# EAGLE schematic Blimp_PCB_v19 (EAGLE 9.7.0)
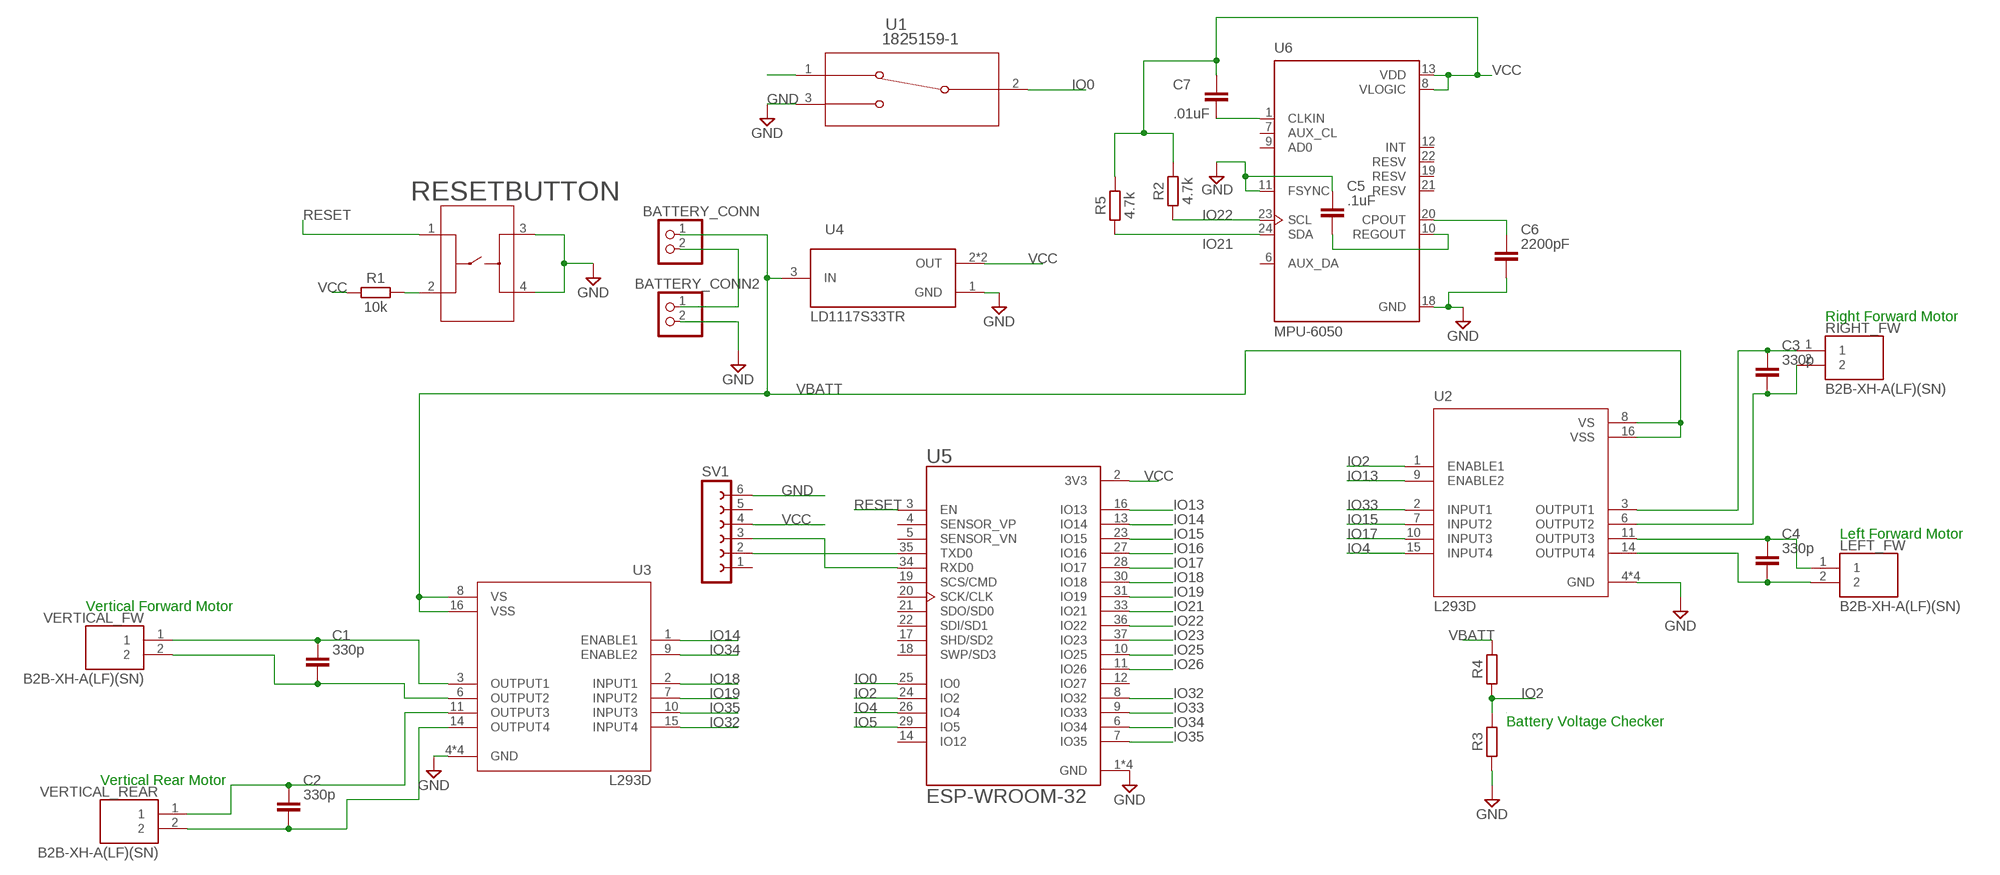
[diagram p0: schematic, sheet 1]

## Parts
BATTERY_CONN  PINHD-1X2  [1X02]
BATTERY_CONN2  PINHD-1X2  [1X02]
C1  330p  C_CHIP-0402(1005-METRIC)  [CAPC1005X60]
C2  330p  C_CHIP-0402(1005-METRIC)  [CAPC1005X60]
C3  330p  C_CHIP-0402(1005-METRIC)  [CAPC1005X60]
C4  330p  C_CHIP-0402(1005-METRIC)  [CAPC1005X60]
C5  .1uF  C_CHIP-0805(2012-METRIC)  [CAPC2012X110]
C6  2200pF  C_CHIP-0805(2012-METRIC)  [CAPC2012X110]
C7  .01uF  C_CHIP-0805(2012-METRIC)  [CAPC2012X110]
LEFT_FW  B2B-XH-A(LF)(SN)  [JST_B2B-XH-A(LF)(SN)]
R1  10k  R_AXIAL-7.2MM-PITCH  [RESAD724W46L381D178B]
R2  4.7k  R_CHIP-1206(3216-METRIC)  [RESC3216X70]
R3  R_AXIAL-7.2MM-PITCH  [RESAD724W46L381D178B]
R4  R_AXIAL-7.2MM-PITCH  [RESAD724W46L381D178B]
R5  4.7k  R_CHIP-1206(3216-METRIC)  [RESC3216X70]
RESETBUTTON  1-1825910-0  [SWITCH_1-1825910-0]
RIGHT_FW  B2B-XH-A(LF)(SN)  [JST_B2B-XH-A(LF)(SN)]
SV1  FE06-1  [FE06]
U1  1825159-1  [SW3-SLIDE-2POL_P98]
U2  L293D  [DIP880W50P254L2000H510Q16]
U3  L293D  [DIP880W50P254L2000H510Q16]
U4  LD1117S33TR  [SOT230P700X180-4N]
U5  ESP-WROOM-32  [MODULE_ESP-WROOM-32]
U6  MPU-6050  [QFN50P400X400X95-24N]
VERTICAL_FW  B2B-XH-A(LF)(SN)  [JST_B2B-XH-A(LF)(SN)]
VERTICAL_REAR  B2B-XH-A(LF)(SN)  [JST_B2B-XH-A(LF)(SN)]

## Nets
GND: BATTERY_CONN2.2 C5.1 C6.2 R3.1 RESETBUTTON.3 RESETBUTTON.4 SV1.6 U1.3 U2.4(GND) U2.5(GND) U2.12(GND) U2.13(GND) U3.4(GND) U3.5(GND) U3.12(GND) U3.13(GND) U4.1(GND) U5.1(GND) U5.1.1(GND) U5.15(GND) U5.38(GND) U6.11(FSYNC) U6.18(GND)
IO0: U1.2 U5.25(IO0)
IO2: R3.2 R4.1 U2.1(ENABLE1) U5.24(IO2)
IO4: U2.15(INPUT4) U5.26(IO4)
IO5: U5.29(IO5)
IO13: U2.9(ENABLE2) U5.16(IO13)
IO14: U3.1(ENABLE1) U5.13(IO14)
IO15: U2.7(INPUT2) U5.23(IO15)
IO16: U5.27(IO16)
IO17: U2.10(INPUT3) U5.28(IO17)
IO18: U3.2(INPUT1) U5.30(IO18)
IO19: U3.7(INPUT2) U5.31(IO19)
IO21: R5.1 U5.33(IO21) U6.24(SDA)
IO22: R2.1 U5.36(IO22) U6.23(SCL)
IO23: U5.37(IO23)
IO25: U5.10(IO25)
IO26: U5.11(IO26)
IO32: U3.15(INPUT4) U5.8(IO32)
IO33: U2.2(INPUT1) U5.9(IO33)
IO34: U3.9(ENABLE2) U5.6(IO34)
IO35: U3.10(INPUT3) U5.7(IO35)
N$1: C3.1 RIGHT_FW.1 U2.3(OUTPUT1)
N$2: C3.2 RIGHT_FW.2 U2.6(OUTPUT2)
N$3: C4.1 LEFT_FW.1 U2.11(OUTPUT3)
N$4: C4.2 LEFT_FW.2 U2.14(OUTPUT4)
N$5: C1.1 U3.3(OUTPUT1) VERTICAL_FW.1
N$6: C1.2 U3.6(OUTPUT2) VERTICAL_FW.2
N$7: C2.1 U3.11(OUTPUT3) VERTICAL_REAR.1
N$8: C2.2 U3.14(OUTPUT4) VERTICAL_REAR.2
N$9: SV1.2 U5.35(TXD0)
N$10: C6.1 U6.20(CPOUT)
N$11: U1.1
N$12: C5.2 U6.10(REGOUT)
N$13: BATTERY_CONN2.1 BATTERY_CONN.2
N$14: C7.2 U6.1(CLKIN)
N$15: R1.2 RESETBUTTON.2
N$22: SV1.3 U5.34(RXD0)
RESET: RESETBUTTON.1 U5.3(EN)
VBATT: BATTERY_CONN.1 R4.2 U2.8(VS) U2.16(VSS) U3.8(VS) U3.16(VSS) U4.3(IN)
VCC: C7.1 R1.1 R2.2 R5.2 SV1.4 U4.2(OUT) U4.4(OUT) U5.2(3V3) U6.8(VLOGIC) U6.13(VDD)
Unconnected: SV1.1 SV1.5 U5.4(SENSOR_VP) U5.5(SENSOR_VN) U5.12(IO27) U5.14(IO12) U5.17(SHD/SD2) U5.18(SWP/SD3) U5.19(SCS/CMD) U5.20(SCK/CLK) U5.21(SDO/SD0) U5.22(SDI/SD1) U6.6(AUX_DA) U6.7(AUX_CL) U6.9(AD0) U6.12(INT) U6.19(RESV) U6.21(RESV) U6.22(RESV)

## Notes on the sheet
- Right Forward Motor
- Left Forward Motor
- Vertical Forward Motor
- Battery Voltage Checker
- Vertical Rear Motor

## Library data of the parts
BATTERY_CONN BATTERY_CONN2 = Connector:PINHD-1X2: PIN HEADER; CATEGORY: CONNECTOR; SUB-CATEGORY: PIN-HEADER
C1-C7 = Capacitor:C: Capacitor - Generic; CATEGORY: Capacitor
LEFT_FW RIGHT_FW VERTICAL_FW VERTICAL_REAR = B2B-XH-A_LF__SN_:B2B-XH-A(LF)(SN): XH Series 2 Position 2.5 mm Pitch Through Hole Top Entry Shrouded Header; MANUFACTURER: JST; PARTREV: N/A; STANDARD: Manufacturer Recommendations
R1-R5 = Resistor:R: Resistor Fixed - Generic; CATEGORY: Resistor; SUB-CATEGORY: Fixed
RESETBUTTON = Switches:1-1825910-0; BUILT_BY: EMA_UL_Team; CATEGORY: Tactile Switches; COPYRIGHT: Copyright (C) 2016 Accelerated Designs. All rights reserved; DESCRIPTION: FSM6JH=6MM TACT SWITCH, HIGH TEMP; MANUFACTURER_PART_NUMBER: 1-1825910-0; PART_STATUS: active; SERIES: Unknown; VENDOR: TE Connectivity
SV1 = con-lsta:FE06-1: FEMALE HEADER; OC_FARNELL: unknown; OC_NEWARK: unknown
U1 = Switches:1825159-1; BUILT_BY: EMA_UL_Team; CATEGORY: Slide Switches; COPYRIGHT: Copyright (C) 2016 Accelerated Designs. All rights reserved; DESCRIPTION: STS121PC04=SPDT SLIDE SWITCH; MANUFACTURER_PART_NUMBER: 1825159-1; PART_STATUS: pending discontinuance; SERIES: Raychem STSS; VENDOR: TE Connectivity
U2 U3 = L293D:L293D: 4-Channel Motor Driver 24V 16-Pin Power PDIP Tube; A_MAX: 5.1; A_MIN: 5.1; A_NOM: 5.1; B_MAX: 0.5; B_MIN: 0.5; B_NOM: 0.5; D_MAX: 20.0; D_MIN: 20.0; D_NOM: 20.0; E1_MAX: 7.1; E1_MIN: 7.1; E1_NOM: 7.1; ENOM: 2.54; E_NOM: 8.8; MANUFACTURER: ST Microelectronics; MAXIMUM_PACKAGE_HEIGHT: 5.1mm; PIN_COUNT: 16.0; STANDARD: IPC 7351B
U4 = LD1117S33TR:LD1117S33TR: LDO Voltage Regulators 3.3V 0.8A Positive; MANUFACTURER: ST Microelectronics
U5 = ESP-WROOM-32:ESP-WROOM-32: Module: combo; GPIO, I2C x2, I2S x2, SDIO, SPI x3, UART x3; 19.5dBm; AVAILABILITY: Warning; DESCRIPTION: Module: combo; GPIO, I2C x2, I2S x2, SDIO, SPI x3, UART x3; 19.5dBm; MF: Olimex LTD; MP: ESP-WROOM-32; PACKAGE: Module Espressif Systems; PRICE: 4.57 USD
U6 = MPU-6050:MPU-6050: MPU-6050 Six-Axis (Gyro + Accelerometer) MEMS MotionTracking™ Devices; AVAILABILITY: Good; DESCRIPTION: IMU ACCEL/GYRO 3-AXIS I2C 24QFN; MF: TDK; MP: MPU-6050; PACKAGE: QFN-24 InvenSense; PARTREV: 3.4; PRICE: 5.45 USD; STANDARD: IPC-7351B